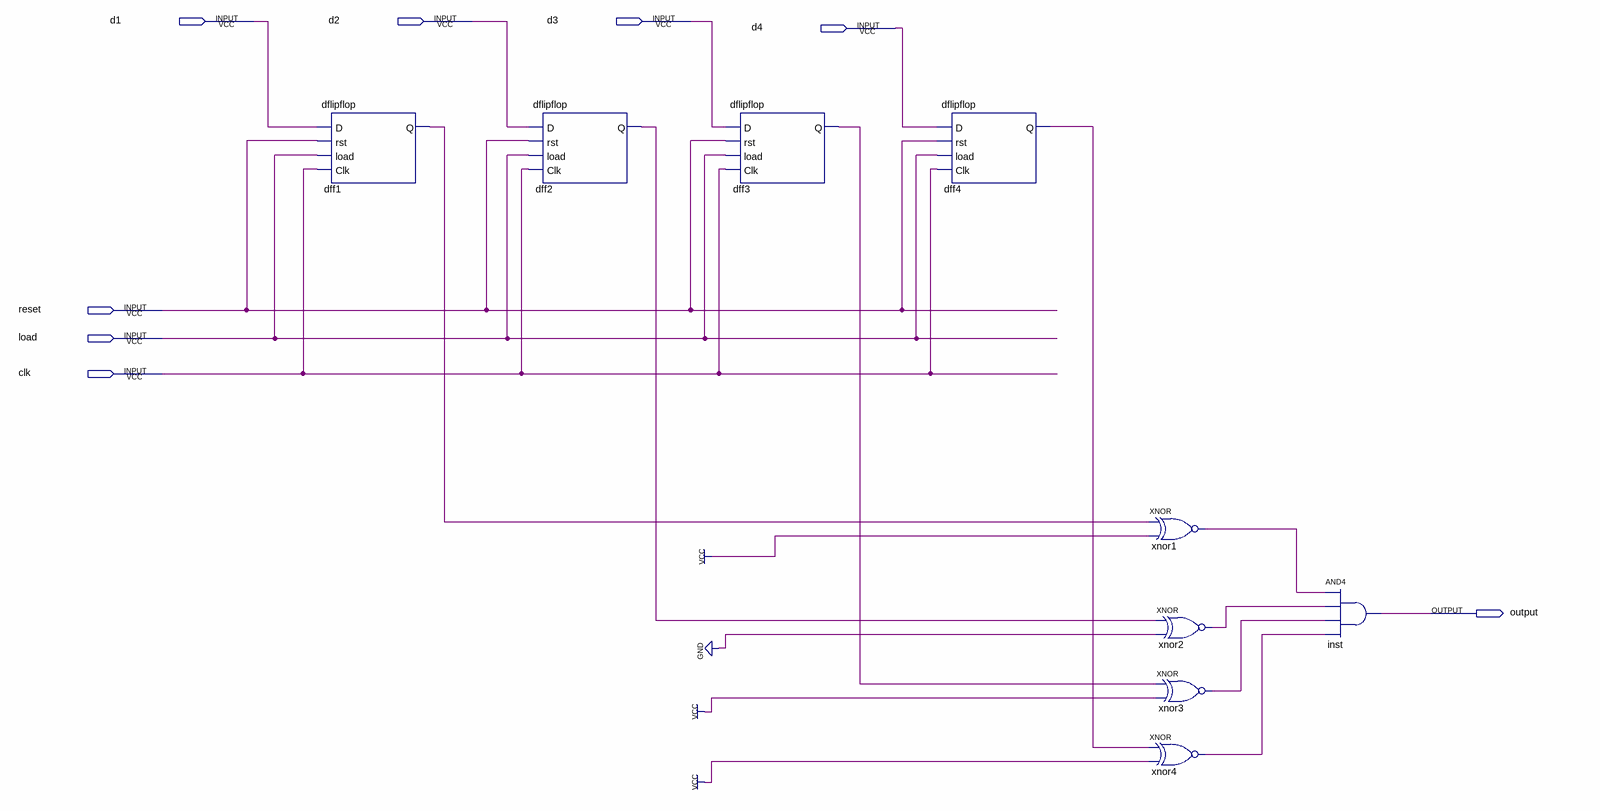
[diagram p0: schematic sheet]
// Quartus schematic hardlock.bdf as structural Verilog: 9 symbols, 8 pins
module hardlock (
  input  d1,
  input  d2,
  input  d3,
  input  d4,
  input  reset,
  input  load,
  input  clk,
  output \output 
);

  wire dff1_q, dff2_q, dff3_q, dff4_q, xnor1_out, xnor2_out, xnor3_out, xnor4_out;

  dflipflop dff1 (.D(d1), .rst(reset), .load(load), .Clk(clk), .Q(dff1_q));
  dflipflop dff2 (.D(d2), .rst(reset), .load(load), .Clk(clk), .Q(dff2_q));
  dflipflop dff3 (.D(d3), .rst(reset), .load(load), .Clk(clk), .Q(dff3_q));
  dflipflop dff4 (.D(d4), .rst(reset), .load(load), .Clk(clk), .Q(dff4_q));
  xnor xnor1 (xnor1_out, dff1_q, 1'b1);
  xnor xnor2 (xnor2_out, dff2_q, 1'b0);
  xnor xnor3 (xnor3_out, dff3_q, 1'b1);
  xnor xnor4 (xnor4_out, dff4_q, 1'b1);
  and inst (\output , xnor1_out, xnor2_out, xnor3_out, xnor4_out);
endmodule
